# Altium project PCB_Project.PrjPcb
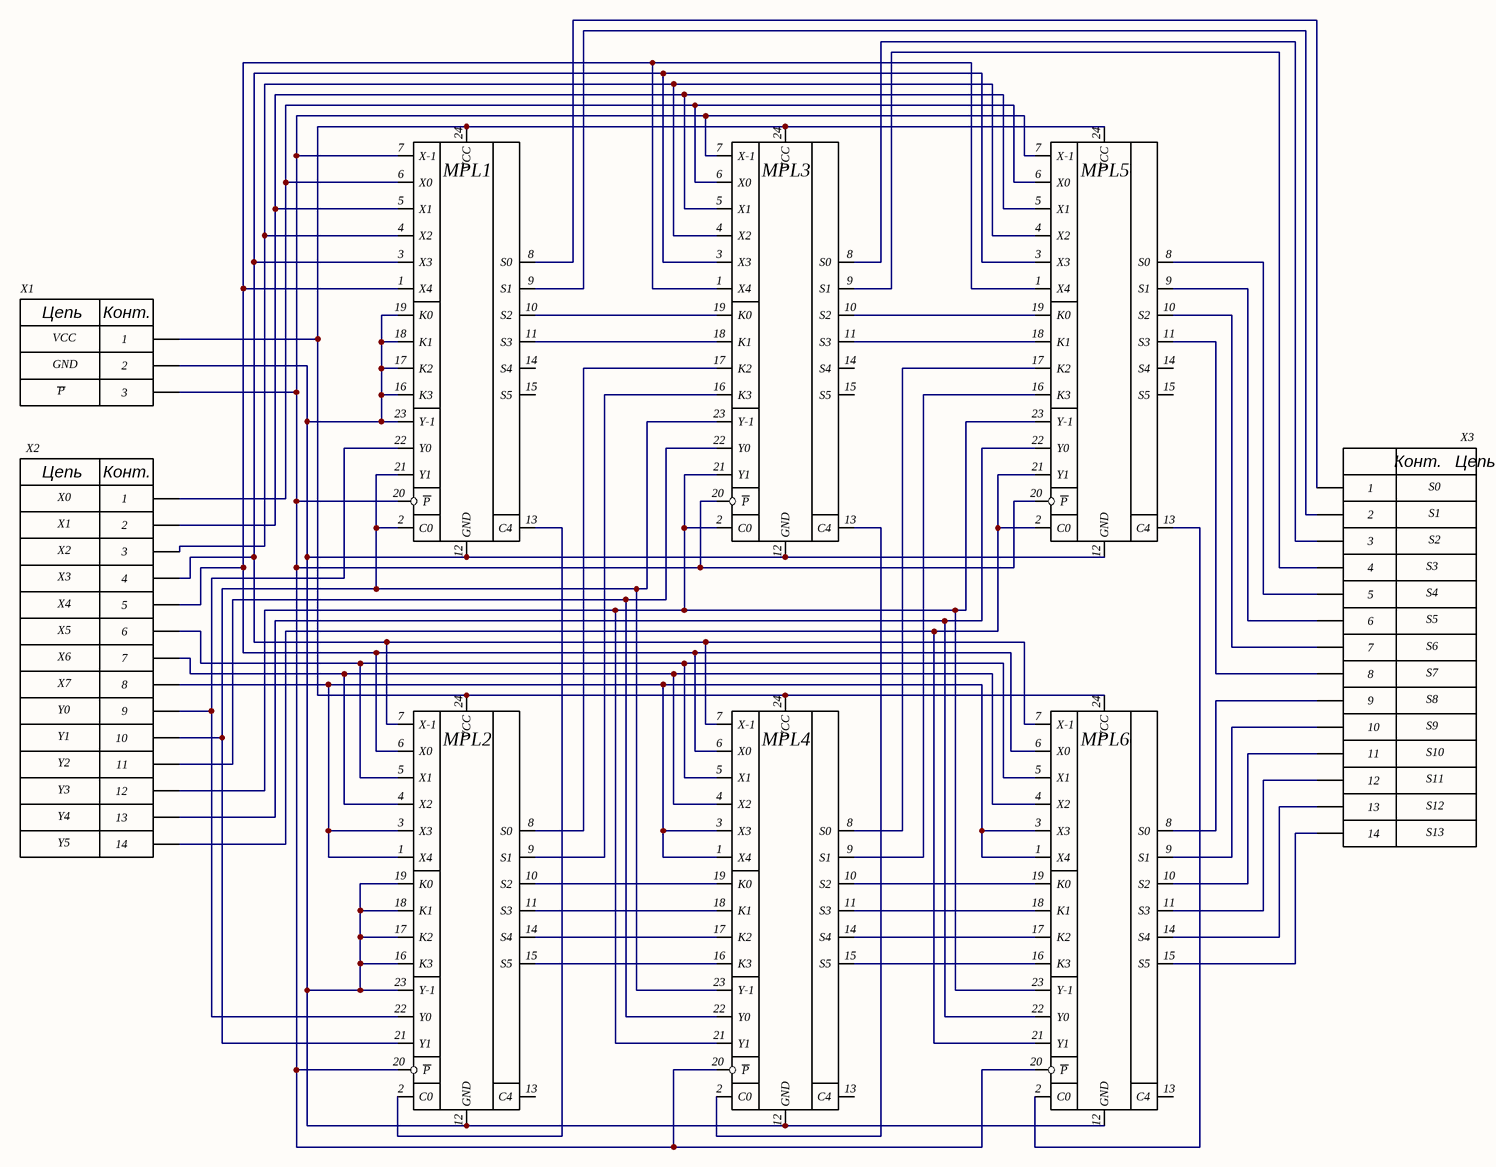
[diagram p0: Sheet1.SchDoc]
1 sheet, 9 parts. Net scope: global (net labels, ports and power ports of the same name join across sheets).
Board file: PCB2.PcbDoc

## Sheet Sheet1.SchDoc
size 420 x 297 mm; Address1: Address1; Address2: Address2; Address3: Address3; Address4: Address4; DocumentNumber: АБВГ.123456.001 Э3; SheetNumber: 1; Scale: 1:1; DocumentType: Схема электрическая принципиальная; FirstReferrence: АБВГ.123456.001

### Parts
MPL1  Complement multiplier  [DIP-24]  (value not drawn)
MPL2  Complement multiplier  [DIP-24]  (value not drawn)
MPL3  Complement multiplier  [DIP-24]  (value not drawn)
MPL4  Complement multiplier  [DIP-24]  (value not drawn)
MPL5  Complement multiplier  [DIP-24]  (value not drawn)
MPL6  Complement multiplier  [DIP-24]  (value not drawn)
X1  3-pins connector  [3-PINS]  (value not drawn)
X2  14-pins connector  [14-PINS]  (value not drawn)
X3  14-pins connector  [14-PINS]  (value not drawn)

### Nets
NetMPL1_1: MPL1.1(X4) MPL2.6(X0) MPL3.1(X4) MPL4.6(X0) MPL5.1(X4) MPL6.6(X0) X2.5
NetMPL1_2: MPL1.2(C0) MPL1.21(Y1) MPL2.21(Y1) MPL3.23(Y-1) MPL4.23(Y-1) X2.10
NetMPL1_3: MPL1.3(X3) MPL2.7(X-1) MPL3.3(X3) MPL4.7(X-1) MPL5.3(X3) MPL6.7(X-1) X2.4
NetMPL1_4: MPL1.4(X2) MPL3.4(X2) MPL5.4(X2) X2.3
NetMPL1_5: MPL1.5(X1) MPL3.5(X1) MPL5.5(X1) X2.2
NetMPL1_6: MPL1.6(X0) MPL3.6(X0) MPL5.6(X0) X2.1
NetMPL1_7: MPL1.7(X-1) MPL1.20(P) MPL2.20(P) MPL3.7(X-1) MPL3.20(P) MPL4.20(P) MPL5.7(X-1) MPL5.20(P) MPL6.20(P) X1.3
NetMPL1_8: MPL1.8(S0) X3.1
NetMPL1_9: MPL1.9(S1) X3.2
NetMPL1_10: MPL1.10(S2) MPL3.19(K0)
NetMPL1_11: MPL1.11(S3) MPL3.18(K1)
NetMPL1_12: MPL1.12(GND) MPL1.16(K3) MPL1.17(K2) MPL1.18(K1) MPL1.19(K0) MPL1.23(Y-1) MPL2.12(GND) MPL2.16(K3) MPL2.17(K2) MPL2.18(K1) MPL2.19(K0) MPL2.23(Y-1) MPL3.12(GND) MPL4.12(GND) MPL5.12(GND) MPL6.12(GND) X1.2
NetMPL1_13: MPL1.13(C4) MPL2.2(C0)
NetMPL1_22: MPL1.22(Y0) MPL2.22(Y0) X2.9
NetMPL1_24: MPL1.24(VCC) MPL2.24(VCC) MPL3.24(VCC) MPL4.24(VCC) MPL5.24(VCC) MPL6.24(VCC) X1.1
NetMPL2_1: MPL2.1(X4) MPL2.3(X3) MPL4.1(X4) MPL4.3(X3) MPL6.1(X4) MPL6.3(X3) X2.8
NetMPL2_4: MPL2.4(X2) MPL4.4(X2) MPL6.4(X2) X2.7
NetMPL2_5: MPL2.5(X1) MPL4.5(X1) MPL6.5(X1) X2.6
NetMPL2_8: MPL2.8(S0) MPL3.17(K2)
NetMPL2_9: MPL2.9(S1) MPL3.16(K3)
NetMPL2_10: MPL2.10(S2) MPL4.19(K0)
NetMPL2_11: MPL2.11(S3) MPL4.18(K1)
NetMPL2_14: MPL2.14(S4) MPL4.17(K2)
NetMPL2_15: MPL2.15(S5) MPL4.16(K3)
NetMPL3_2: MPL3.2(C0) MPL3.21(Y1) MPL4.21(Y1) MPL5.23(Y-1) MPL6.23(Y-1) X2.12
NetMPL3_8: MPL3.8(S0) X3.3
NetMPL3_9: MPL3.9(S1) X3.4
NetMPL3_10: MPL3.10(S2) MPL5.19(K0)
NetMPL3_11: MPL3.11(S3) MPL5.18(K1)
NetMPL3_13: MPL3.13(C4) MPL4.2(C0)
NetMPL3_22: MPL3.22(Y0) MPL4.22(Y0) X2.11
NetMPL4_8: MPL4.8(S0) MPL5.17(K2)
NetMPL4_9: MPL4.9(S1) MPL5.16(K3)
NetMPL4_10: MPL4.10(S2) MPL6.19(K0)
NetMPL4_11: MPL4.11(S3) MPL6.18(K1)
NetMPL4_14: MPL4.14(S4) MPL6.17(K2)
NetMPL4_15: MPL4.15(S5) MPL6.16(K3)
NetMPL5_2: MPL5.2(C0) MPL5.21(Y1) MPL6.21(Y1) X2.14
NetMPL5_8: MPL5.8(S0) X3.5
NetMPL5_9: MPL5.9(S1) X3.6
NetMPL5_10: MPL5.10(S2) X3.7
NetMPL5_11: MPL5.11(S3) X3.8
NetMPL5_13: MPL5.13(C4) MPL6.2(C0)
NetMPL5_22: MPL5.22(Y0) MPL6.22(Y0) X2.13
NetMPL6_8: MPL6.8(S0) X3.9
NetMPL6_9: MPL6.9(S1) X3.10
NetMPL6_10: MPL6.10(S2) X3.11
NetMPL6_11: MPL6.11(S3) X3.12
NetMPL6_14: MPL6.14(S4) X3.13
NetMPL6_15: MPL6.15(S5) X3.14

Not connected (* = marked no-connect by the designer): MPL1 14(S4) 15(S5); MPL2 13(C4); MPL3 14(S4) 15(S5); MPL4 13(C4); MPL5 14(S4) 15(S5); MPL6 13(C4)

### Notes on the sheet
- GND
- VCC
- P
- X0
- S0
- S1
- X1
- X2
- X3
- S3
- S2
- X4
- X5
- S4
- S5
- S6
- X6
- X7
- Y0
- S7
- S8
- Y1
- Y2
- S9
- S10
- S11
- Y3
- Y4
- Y5
- S12
- S13
- Перв. примен.
- Справ. №
- Подп. и дата
- Инв. № дубл.
- Взам. инв. №
- Разраб.
- Изм.
- Лист
- № докум.
- Подп.
- Дата
- Лит.
- Масса
- Масштаб
- Пров.
- Т.контр.
- Листов
- Инв. № подл.
- Утв.
- Н.контр.
- 2.106-A3
- Копировал
- Формат А3
- (in symbol WM14660-ND) Цепь; Конт.
- (in symbol WM17469-ND) Цепь; Конт.

### Library data of the parts
MPL1-MPL6 = Am25S05
X1 = WM14660-ND
X2 X3 = WM17469-ND